# EAGLE design Solar Scramble (EAGLE 8.6.0)
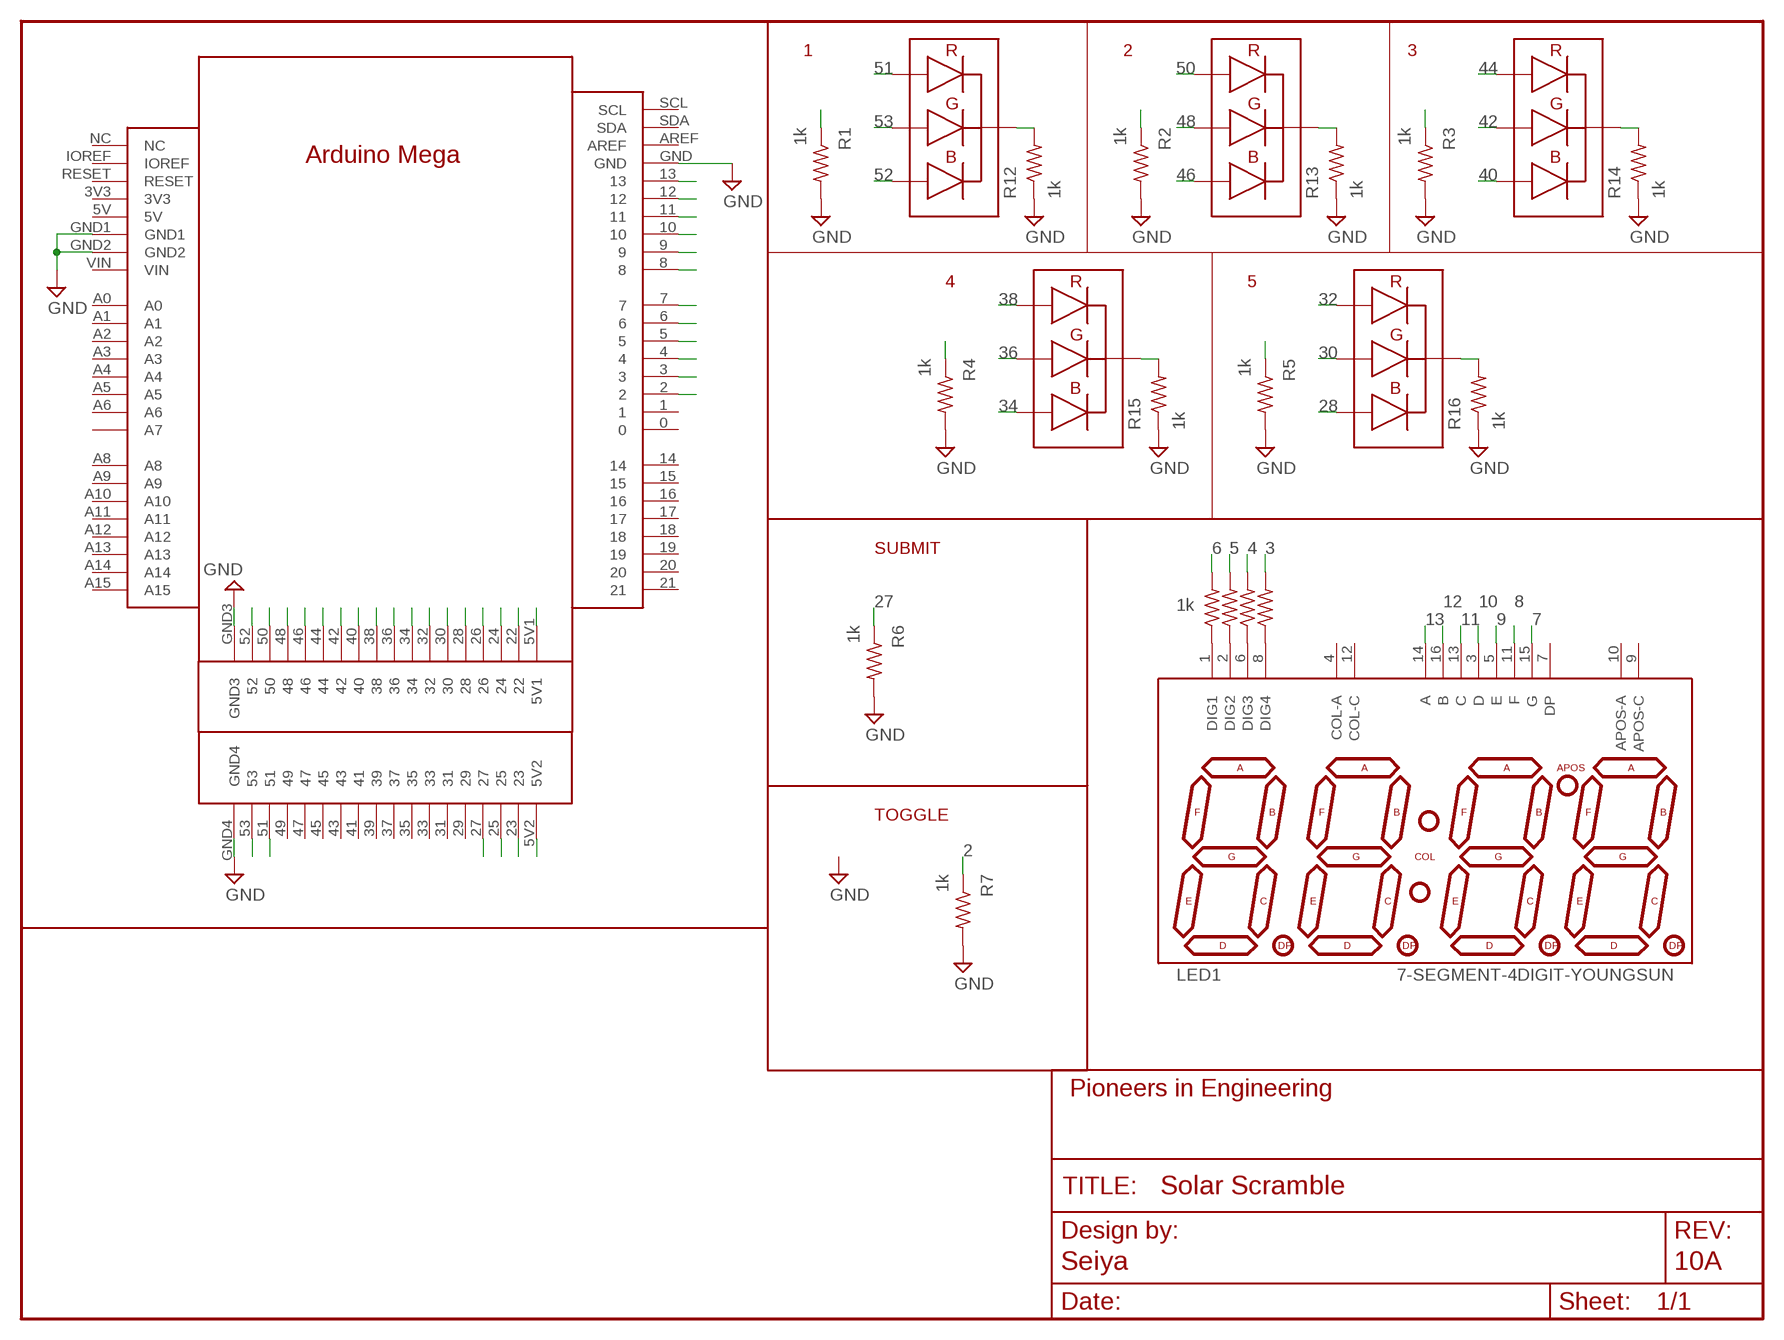
[diagram p0: schematic, sheet 1]
FRAME1 (FRAME_SCHEMATIC): AUTHOR: Seiya; REVISION: 10A

## Parts
LED1  7-SEGMENT-4DIGIT-YOUNGSUN  [7-SEGMENT-4DIGIT-YOUNGSUN]
R1  1k  R-US_R0603  [R0603]
R2  1k  R-US_R0603  [R0603]
R3  1k  R-US_R0603  [R0603]
R4  1k  R-US_R0603  [R0603]
R5  1k  R-US_R0603  [R0603]
R6  1k  R-US_R0603  [R0603]
R7  1k  R-US_R0603  [R0603]
R8  1ik  R-US_R0603  [R0603]
R9  1k  R-US_R0603  [R0603]
R10  1k  R-US_R0603  [R0603]
R11  1k  R-US_R0603  [R0603]
R12  1k  R-US_R0603  [R0603]
R13  1k  R-US_R0603  [R0603]
R14  1k  R-US_R0603  [R0603]
R15  1k  R-US_R0603  [R0603]
R16  1k  R-US_R0603  [R0603]
U$1  ARD_MEGA  [ARD_MEGA]
U$2  TRI-LED  [TRI-LED]
U$3  TRI-LED  [TRI-LED]
U$4  TRI-LED  [TRI-LED]
U$5  TRI-LED  [TRI-LED]
U$6  TRI-LED  [TRI-LED]

## Nets
2: R7.1 U$1.2
3: R11.2 U$1.3
4: R10.2 U$1.4
5: R9.2 U$1.5
5V: U$1.5V1 U$1.5V2
6: R8.2 U$1.6
7: LED1.15(G) U$1.7
8: LED1.11(F) U$1.8
9: LED1.5(E) U$1.9
10: LED1.3(D) U$1.10
11: LED1.13(C) U$1.11
12: LED1.16(B) U$1.12
13: LED1.14(A) U$1.13
22: R1.1 U$1.22
23: R2.1 U$1.23
24: R3.1 U$1.24
25: R4.1 U$1.25
26: R5.1 U$1.26
27: R6.1 U$1.27
28: U$1.28 U$5.B
30: U$1.30 U$5.G
32: U$1.32 U$5.R
34: U$1.34 U$4.B
36: U$1.36 U$4.G
38: U$1.38 U$4.R
40: U$1.40 U$3.B
42: U$1.42 U$3.G
44: U$1.44 U$3.R
46: U$1.46 U$6.B
48: U$1.48 U$6.G
50: U$1.50 U$6.R
51: U$1.51 U$2.R
52: U$1.52 U$2.B
53: U$1.53 U$2.G
GND: R1.2 R2.2 R3.2 R4.2 R5.2 R6.2 R7.2 R12.1 R13.1 R14.1 R15.1 R16.1 U$1.GND U$1.GND1 U$1.GND2 U$1.GND3 U$1.GND4
N$1: R15.2 U$4.GND(CAT)
N$2: R12.2 U$2.GND(CAT)
N$3: LED1.1(DIG1) R8.1
N$4: LED1.2(DIG2) R9.1
N$5: LED1.6(DIG3) R10.1
N$6: LED1.8(DIG4) R11.1
N$7: R13.2 U$6.GND(CAT)
N$8: R14.2 U$3.GND(CAT)
N$9: R16.2 U$5.GND(CAT)
Unconnected: LED1.4(COL-A) LED1.7(DP) LED1.9(APOS-C) LED1.10(APOS-A) LED1.12(COL-C) U$1.0 U$1.1 U$1.3V3 U$1.5V U$1.14 U$1.15 U$1.16 U$1.17 U$1.18 U$1.19 U$1.20 U$1.21 U$1.29 U$1.31 U$1.33 U$1.35 U$1.37 U$1.39 U$1.41 U$1.43 U$1.45 U$1.47 U$1.49 U$1.A0 U$1.A1 U$1.A2 U$1.A3 U$1.A4 U$1.A5 U$1.A6 U$1.A7 U$1.A8 U$1.A9 U$1.A10 U$1.A11 U$1.A12 U$1.A13 U$1.A14 U$1.A15 U$1.AREF U$1.IOREF U$1.NC U$1.RESET U$1.SCL U$1.SDA U$1.VIN

## Notes on the sheet
- 1 | 2 | 3
- 4 | 5
- SUBMIT
- TOGGLE

## Library data of the parts
LED1 = pie:7-SEGMENT-4DIGIT-YOUNGSUN: This is a part for the 4-Digit 7-segment LEDs from Young Sun. Different from the Digikey LEDs, all 16 pins are used. The LONGPADS Variant is used for a test jig, but you may like it because there is more pad to solder to. If you are concerned about routing space, the standard works just fine though.
R1-R3 R5-R16 = pie:R-US_: RESISTOR, American symbol; DESCRIPTION: RESISTOR, American symbol; DISTRIBUTOR: DigiKey; MANUFACTURER: Rohm Semiconductor; NOTES: Cut Tape; PACKAGE: R0603; VALUE: >VALUE
R4 = pie:R-US_: RESISTOR, American symbol; DESCRIPTION: RESISTOR, American symbol; DISTRIBUTOR: DigiKey; MANUFACTURER: Rohm Semiconductor; NOTES: Cut Tape; PACKAGE: R0603; SPICEPREFIX: R; VALUE: >VALUE
U$1 = pie:ARD_MEGA: Arduino Mega
U$2-U$6 = pie:TRI-LED

## Board
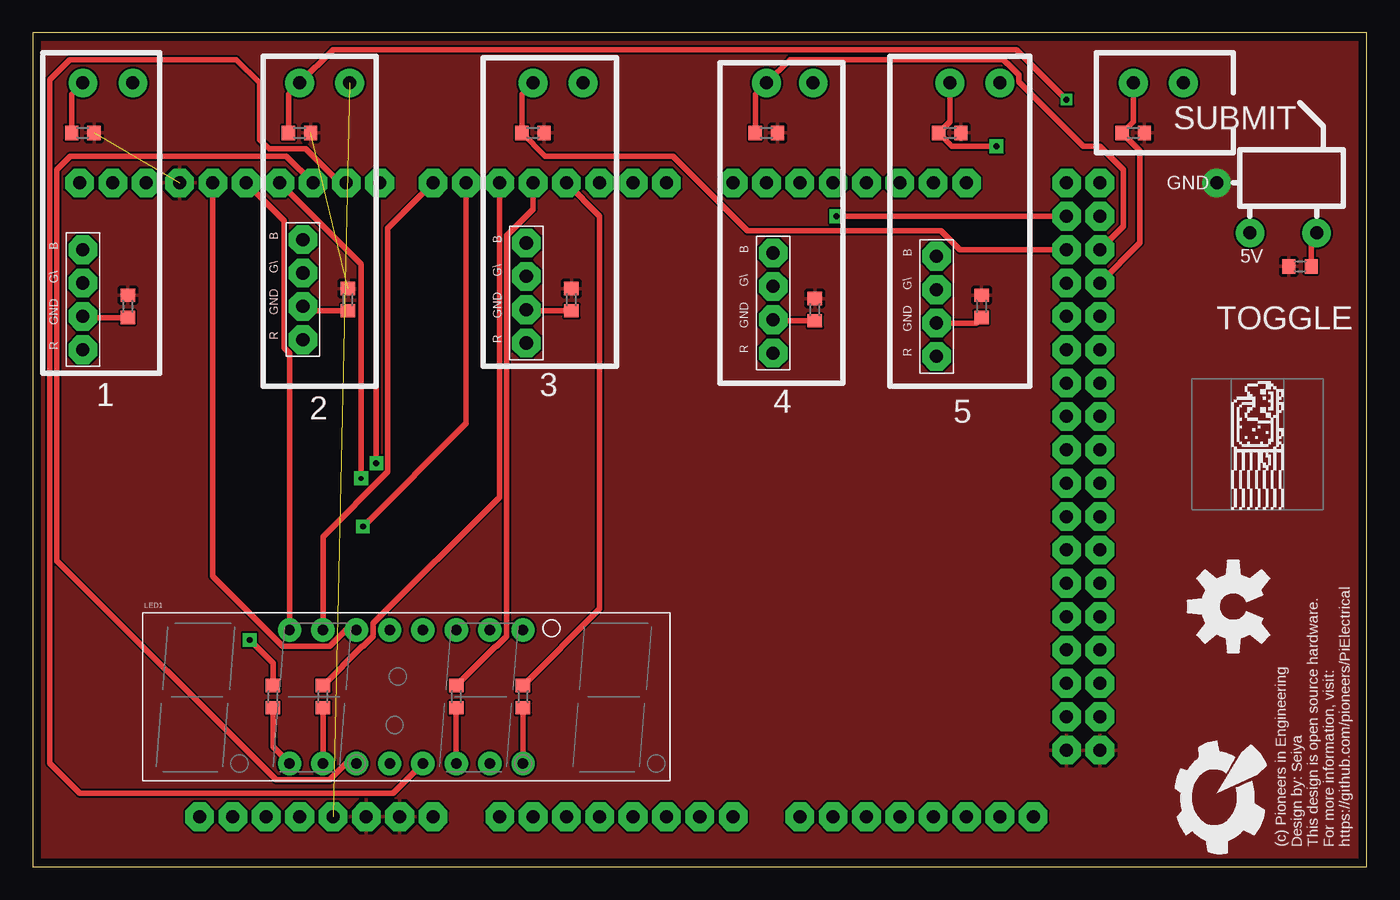
[diagram p1: board, top side]
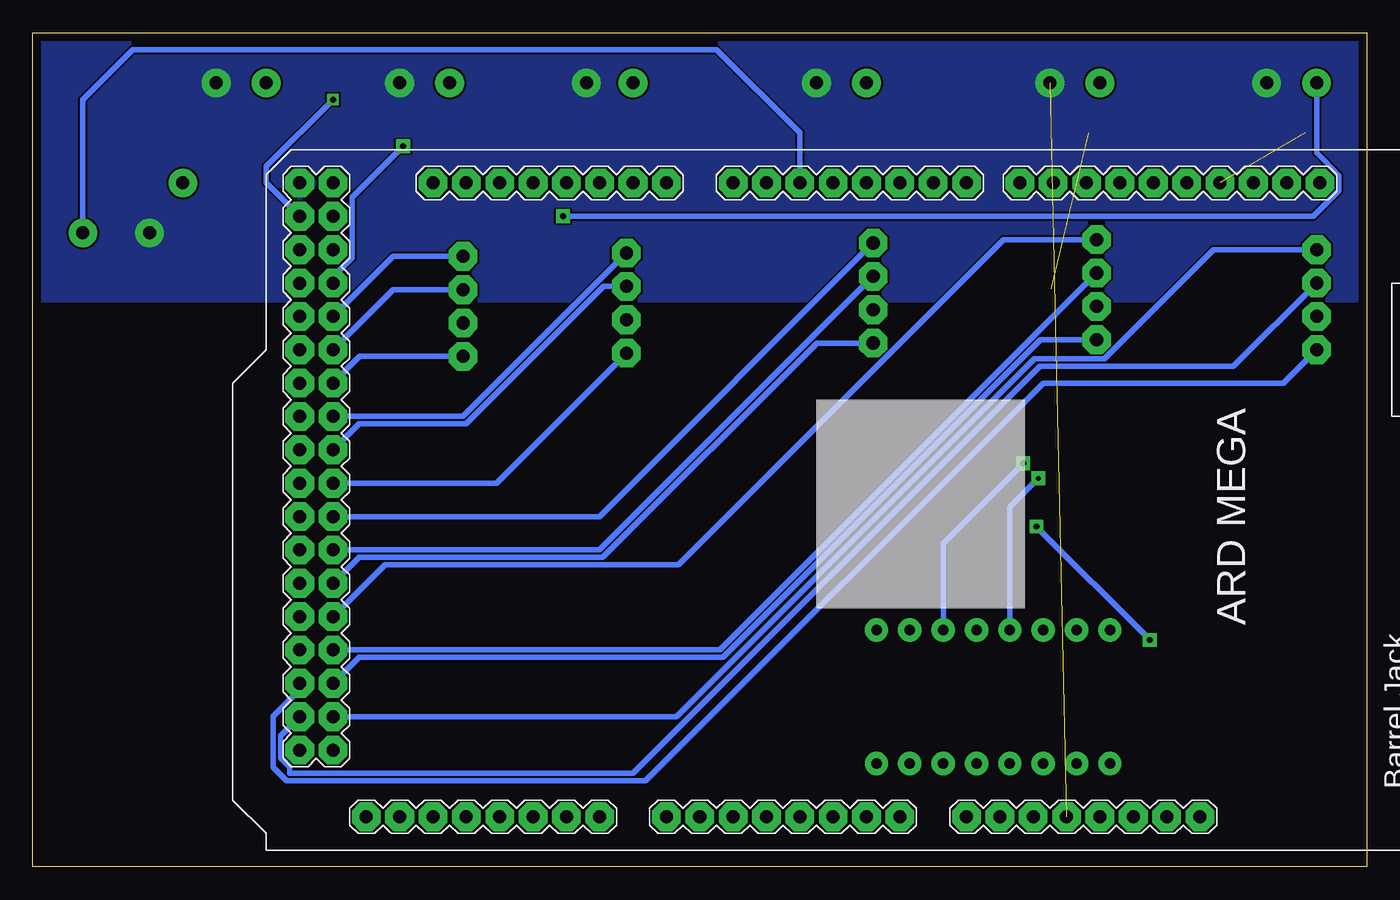
[diagram p2: board, bottom side, seen from below]

Size 101.6 x 63.5 mm. Coordinates in mm from the lower left corner, seen from the top.
Outline: 0,0 101.6,0 101.6,63.5 0,63.5 0,0
Copper layers (1*16): Top 2mil / dielectric 9mil / Bottom 2mil
Design rules "pie": minimum track width 6mil, minimum drill 15mil, track to track 6mil, track to pad 6mil, pad to pad 6mil, via to via 6mil, smd to smd 6mil, copper to edge 25mil, drill to drill 7mil, minimum pad ring 7mil, minimum via ring 7mil, stop-mask expansion 3mil, vias tented up to drill 21mil, thermal gap 10mil

### Footprints (pad centres in the part's own frame; a part is rotated, then mirrored left to right if it is on the bottom)
7-SEGMENT-4DIGIT-YOUNGSUN = drill 0.8 pad 1.778: 1 -8.89,-5.08; 2 -6.35,-5.08; 3 -3.81,-5.08; 4 -1.27,-5.08; 5 1.27,-5.08; 6 3.81,-5.08; 7 6.35,-5.08; 8 8.89,-5.08; 9 8.89,5.08; 10 6.35,5.08; 11 3.81,5.08; 12 1.27,5.08; 13 -1.27,5.08; 14 -3.81,5.08; 15 -6.35,5.08; 16 -8.89,5.08
R0603 = smd 1 x 1.1: 1 -0.85,0; 2 0.85,0
ARD_MEGA = drill 0.991 pad 2.184 octagon: 0 50.8,38.1; 1 50.8,40.64; 2 50.8,43.18; 3 50.8,45.72; 3V3 2.54,66.04; 4 50.8,48.26; 5 50.8,50.8; 5V 50.8,7.62; 5V1 50.8,5.08; 5V2 2.54,63.5; 6 50.8,53.34; 7 50.8,55.88; 8 50.8,59.944; 9 50.8,62.484; 10 50.8,65.024; 11 50.8,67.564; 12 50.8,70.104; 13 50.8,72.644; 14 50.8,33.02; 15 50.8,30.48; 16 50.8,27.94; 17 50.8,25.4; 18 50.8,22.86; 19 50.8,20.32; 20 50.8,17.78; 21 50.8,15.24; 22 48.26,7.62; 23 48.26,5.08; 24 45.72,7.62; 25 45.72,5.08; 26 43.18,7.62; 27 43.18,5.08; 28 40.64,7.62; 29 40.64,5.08; 30 38.1,7.62; 31 38.1,5.08; 32 35.56,7.62; 33 35.56,5.08; 34 33.02,7.62; 35 33.02,5.08; 36 30.48,7.62; 37 30.48,5.08; 38 27.94,7.62; 39 27.94,5.08; 40 25.4,7.62; 41 25.4,5.08; 42 22.86,7.62; 43 22.86,5.08; 44 20.32,7.62; 45 20.32,5.08; 46 17.78,7.62; 47 17.78,5.08; 48 15.24,7.62; 49 15.24,5.08; 50 12.7,7.62; 51 12.7,5.08; 52 10.16,7.62; 53 10.16,5.08; A0 2.54,50.8; A1 2.54,48.26; A2 2.54,45.72; A3 2.54,43.18; A4 2.54,40.64; A5 2.54,38.1; A6 2.54,35.56; A7 2.54,33.02; A8 2.54,27.94; A9 2.54,25.4; A10 2.54,22.86; A11 2.54,20.32; A12 2.54,17.78; A13 2.54,15.24; A14 2.54,12.7; A15 2.54,10.16; AREF 50.8,77.724; GND 50.8,75.184; GND1 2.54,60.96; GND2 2.54,58.42; GND3 7.62,7.62; GND4 7.62,5.08; IOREF 2.54,71.12; NC 2.54,73.66; RESET 2.54,68.58; SCL 50.8,82.804; SDA 50.8,80.264; VIN 2.54,55.88
TRI-LED = drill 1 pad 2.184 octagon: B 3.81,0; G 1.27,0; GND -1.27,0; R -3.81,0

### Placement (x,y rotation side)
LED1  28.45,12.95 0 top
R1  3.81,55.88 0 top
R2  20.32,55.88 0 top
R3  38.1,55.88 0 top
R4  55.88,55.88 0 top
R5  69.85,55.88 0 top
R6  83.82,55.88 0 top
R7  96.52,45.72 180 top
R8  18.29,12.95 90 top
R9  22.1,12.95 90 top
R10  32.26,12.95 90 top
R11  37.34,12.95 90 top
R12  7.24,42.67 270 top
R13  24,43.18 270 top
R14  41.02,43.18 270 top
R15  59.56,42.42 270 top
R16  72.26,42.67 270 top
U$1  86.36,1.27 90 top
U$2  3.81,43.18 90 top
U$3  37.59,43.69 90 top
U$4  56.39,42.93 90 top
U$5  68.83,42.67 90 top
U$6  20.57,43.94 90 top
U$7  [NYAN-1CM]  98.3,27.18 90 top
U$8  [OSHW-LOGO-L]  91.44,19.81 90 top
U$9  [PIE-LOGO-SMALL]  90.17,5.59 90 top

### Tracks (layer width: path | path; a pad name or v marks a point on that pad's centre or on a via)
2  (via drill 0.99 pad 2.18)
  Top 0.406: v97.79,48.26 97.37,47.84 R7.1
  Bottom 0.406: v97.79,48.26 97.79,58.42 93.98,62.23 49.53,62.23 43.18,55.88 U$1.2
3
  Top 0.406: U$1.3 43.18,49.53 43.18,19.65 R11.2
4
  Top 0.406: R10.2 35.24,16.79 35.31,16.79 36.09,17.57 36.09,48.05 38.1,50.05 U$1.4
5
  Top 0.406: R9.2 25.08,16.79 25.15,16.79 25.93,17.57 25.93,18.55 35.53,28.15 35.53,48.28 35.56,48.3 U$1.5
5V  (via drill 0.99 pad 2.18)  (1 unrouted)
  other vias: 7.62,59.69 92.71,48.26 24.13,59.69 41.91,59.69 59.44,59.69 73.66,59.69 87.63,59.69
  pour Bottom: 0,63.5 101.6,63.5 101.6,43.18 0,43.18
6  (via drill 0.45 pad 1.05)
  Top 0.406: R8.2 18.29,15.49 v16.51,17.27 | v25.15,25.91 33.02,33.78 U$1.6
  Bottom 0.406: v16.51,17.27 v25.15,25.91
7
  Top 0.406: U$1.7 27.04,48.63 27.04,30.06 22.1,25.12 LED1.15
8  (via drill 0.45 pad 1.05)
  Top 0.406: v26.16,30.73 26.16,51.82 U$1.8
  Bottom 0.406: LED1.11 32.26,24.64 v26.16,30.73
9
  Top 0.406: LED1.5 27.43,5.59 3.56,5.59 1.27,7.87 1.27,59.94 2.79,61.47 15.49,61.47 17.27,59.69 17.27,55.37 17.98,54.66 20.79,54.66 23.38,52.07 U$1.9
10
  Top 0.406: LED1.3 23.86,7.87 22.61,6.63 18.52,6.63 1.83,23.32 1.83,53.09 2.85,54.1 19.3,54.1 U$1.10
11  (via drill 0.35 pad 1.05)
  Top 0.406: v25,29.58 25,45.86 U$1.11
  Bottom 0.406: LED1.13 27.18,27.4 v25,29.58
12
  Top 0.406: LED1.16 19.56,39.1 19.13,39.53 19.13,49.2 U$1.12
13
  Top 0.406: LED1.14 23.86,18.03 22.61,16.79 19.04,16.79 13.72,22.12 U$1.13
22  (via drill 0.45 pad 1.05, 0.99 pad 2.18)
  Top 0.406: R1.1 2.96,58.84 v3.81,59.69 | v61.21,49.53 U$1.22
  Bottom 0.406: v3.81,59.69 3.81,54.37 2.11,52.67 2.11,51.47 4.05,49.53 v61.21,49.53
23  (via drill 0.45 pad 0.9, 0.99 pad 2.18)
  Top 0.406: R2.1 19.47,58.84 v20.32,59.69 22.86,62.23 74.93,62.23 v78.74,58.42
  Bottom 0.406: v78.74,58.42 83.82,53.34 83.82,52.07 U$1.23
24  (via drill 0.99 pad 2.18)
  Top 0.406: v38.1,59.69 37.25,58.84 R3.1 39.03,54.1 48.77,54.1 54.43,48.44 69.18,48.44 70.63,46.99 U$1.24
25  (via drill 0.99 pad 2.18)
  Top 0.406: R4.1 55.03,58.84 v55.88,59.69 57.66,61.47 73.91,61.47 74.24,61.14 74.26,61.14 75.11,60.29 75.11,59.77 80.01,54.86 81.28,54.86 83.06,53.09 83.06,48.77 U$1.25
26  (via drill 0.45 pad 1.05, 0.99 pad 2.18)
  Top 0.406: v69.85,59.69 69.85,56.73 R5.1 70.02,54.86 v73.41,54.86
  Bottom 0.406: v73.41,54.86 77.29,50.98 77.29,46.39 78.74,44.94 U$1.26
27  (via drill 0.99 pad 2.18)
  Top 0.406: v83.82,59.69 83.82,56.73 R6.1 84.33,54.52 84.33,47.5 U$1.27
28
  Bottom 0.406: U$5.B 74.17,46.48 U$1.28
30
  Bottom 0.406: U$5.G 74.17,43.94 U$1.30
32
  Bottom 0.406: U$5.R 76.71,38.86 U$1.32
34
  Bottom 0.406: U$1.34 68.83,34.29 U$4.B
36
  Bottom 0.406: U$4.G 58.14,44.2 68.6,33.73 76.76,33.73 U$1.36
38
  Bottom 0.406: U$1.38 66.29,29.21 U$4.R
40
  Bottom 0.406: U$1.40 58.42,26.67 U$3.B
42
  Bottom 0.406: U$3.G 58.42,24.13 U$1.42
44
  Bottom 0.406: U$1.44 76.76,23.57 58.19,23.57 41.88,39.88 U$3.R
46
  Bottom 0.406: U$1.46 74.78,23.01 52.41,23.01 27.67,47.75 U$6.B
48
  Bottom 0.406: U$6.G 49.28,16.51 U$1.48
50
  Bottom 0.406: U$1.50 76.76,15.95 49.05,15.95 24.86,40.13 U$6.R
51
  Bottom 0.406: U$1.51 81.28,13.48 83.29,11.47 83.29,7.57 82.27,6.55 54.91,6.55 24.64,36.83 6.35,36.83 U$2.R
52
  Bottom 0.406: U$1.52 52.58,11.43 25.32,38.68 19.97,38.68 11.67,46.99 U$2.B
53
  Bottom 0.406: U$2.G 10.16,38.1 24.89,38.1 55.88,7.11 82.04,7.11 82.04,7.6 82.73,8.29 82.73,9.98 U$1.53
GND  (via drill 0.99 pad 2.18)  (2 unrouted)
  other vias: 90.17,52.07
  pour Top: 0,63.5 0,0 101.6,0 101.6,63.5
N$1
  Top 0.406: R15.2 56.48,41.57 U$4.GND
N$2
  Top 0.406: R12.2 3.9,41.82 U$2.GND
N$3
  Top 0.406: R8.1 18.29,9.14 LED1.1
N$4
  Top 0.406: R9.1 LED1.2
N$5
  Top 0.406: R10.1 LED1.6
N$6
  Top 0.406: R11.1 LED1.8
N$7
  Top 0.406: R13.2 20.92,42.33 U$6.GND
N$8
  Top 0.406: R14.2 37.68,42.33 U$3.GND
N$9
  Top 0.406: U$5.GND 71.84,41.4 R16.2

### Text on the board
tPlace: SUBMIT | GND | 5V | TOGGLE | 3 | 1 | 4 | 2 | 5 | (c) Pioneers in Engineering / Design by: Seiya / This design is open source hardware. / For more information, visit: / https://github.com/pioneers/PiElectrical